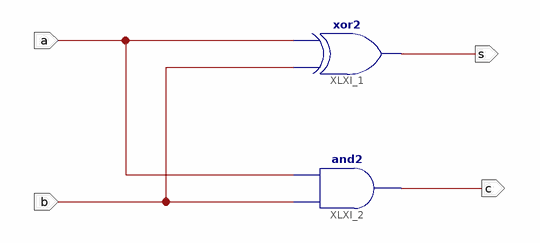
[diagram p0: schematic sheet 1]
// Xilinx ISE schematic SCHEMAT.sch (spartan3e) as structural Verilog: 2 symbols, 4 ports
module SCHEMAT (
  input  b,
  input  a,
  output s,
  output c
);

  xor XLXI_1 (s, b, a);
  and XLXI_2 (c, b, a);
endmodule
